# EasyEDA Pro project SD-Swicharoo.eprj, board MicroSD Adapter
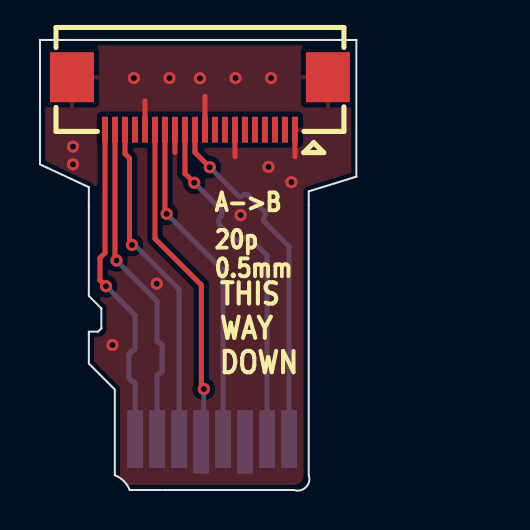
[diagram p4: board, top side]
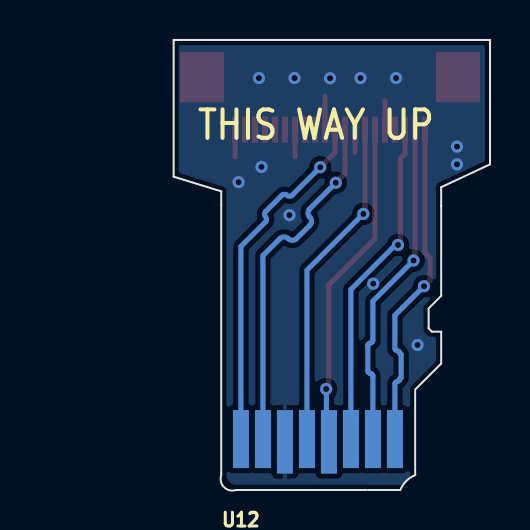
[diagram p5: board, bottom side, seen from below]

Outline 22.51 x 22.51 mm; copper layers: Top Layer, Bottom Layer. Coordinates in mm from the lower left corner of the outline.
Outline path: 2.44,14.21 2.44,15.15 0,16.29 0,22.51 15.82,22.51 15.82,15.68 13.44,14.94 13.44,14.26
Stack: Top Layer 0.035mm / Dielectric1 0.91mm FR4 er 4.5 / Bottom Layer 0.035mm

## Design rules (mm)
template: Custom Config
spacing copperThickness1oz (default): track to track 0.102, other pairs 0.152 to 0.3
spacing copperThickness2oz: track to track 0.203, other pairs 0.152 to 0.3
track width copperThickness1oz (default): min 0.127, default 0.254, max 2.54
track width copperThickness2oz: min 0.203, default 0.254, max 2.54
differential pair differentialPair (default): width min 0.127, default 0.254, max 2.54; gap min 0.152, default 0.152
via viaSize (default): diameter min 0.5, default 0.61, max 10; hole min 0.3, default 0.305, max 6.3

## Placement (name value [footprint] x y rotation side)
U11  05A20L20P  [FPC-SMD_20P-P0.50_L5.9-W14.4]  8 19.34 180 top
U12  U12  [MICROSD]  12.7 14.26 180 bottom

## Footprints (pads in the part's own frame, mm; a bottom-side part is the same pattern mirrored in y, then rotated)
FPC-SMD_20P-P0.50_L5.9-W14.4
  rect 0.3x1.3 smd: 1(-4.75,1.312) 2(-4.25,1.312) 3(-3.75,1.312) 4(-3.25,1.312) 5(-2.75,1.312) 6(-2.25,1.312) 7(-1.75,1.312) 8(-1.25,1.312) 9(-0.75,1.312) 10(-0.25,1.312) 11(0.25,1.312) 12(0.75,1.312) 13(1.25,1.312) 14(1.75,1.312) 15(2.25,1.312) 16(2.75,1.312) 17(3.25,1.312) 18(3.75,1.312) 19(4.25,1.312) 20(4.75,1.312)
  rect 2.2x2.5 smd: 21(-6.4,-1.312) 22(6.4,-1.312)
MICROSD
  custom 0.8x2.9 smd: 1(7.943,-11.711) 2(6.843,-11.711) 3(5.742,-11.711) 5(3.543,-11.711) 7(1.343,-11.711) 8(0.243,-11.711)
  custom 0.8x3.175 smd: 4(4.643,-11.85) 6(2.442,-11.85)

## Nets
As in the schematic.

Pads without a net: U11 2 3 4 5 6 8 9 17

## Via types
v1: diameter 0.61, hole 0.305, Top Layer to Bottom Layer, 19 vias

## Routing (per net, layer and track width the routed paths; a pad name or vN(x,y) marks a point on that pad's centre or on a via; arc(x,y) is an arc through that point)
SDIN_CLK: length 17.4
  Top Layer w0.254: v1(6.34,13.81) 6.25,13.9 U11.14
  Bottom Layer w0.254: v1(6.34,13.81) 9.16,10.99 9.16,1.79
SDIN_CMD: length 17.4
  Top Layer w0.254: U11.18 4.25,16.82 4.48,16.6 4.48,12.39 4.6,12.26
  Bottom Layer w0.254: 6.96,1.79 6.96,10.03 4.73,12.26 4.6,12.26
  vias: v1(4.6,12.26)
SDIN_DAT0: length 18.6
  Top Layer w0.254: v1(7.72,15.37) 7.26,15.83 U11.12
  Bottom Layer w0.254: 11.36,1.79 11.36,11.73 10.51,12.58 arc(10.31,12.66) 10.1,12.58 arc(9.89,12.49) 9.68,12.58 9.02,13.24 arc(8.93,13.45) 9.02,13.65 arc(9.11,13.86) 9.02,14.07 v1(7.72,15.37)
SDIN_DAT1: length 18.6
  Top Layer w0.254: v1(8.49,16.15) 7.76,16.89 U11.11
  Bottom Layer w0.254: 12.46,1.79 12.46,12.18 11.23,13.41 arc(11.18,13.54) 11.23,13.67 arc(11.29,13.8) 11.23,13.92 10.41,14.75 arc(10.29,14.8) 10.16,14.75 arc(10.03,14.69) 9.9,14.75 v1(8.49,16.15)
SDIN_DAT2: length 17.4
  Top Layer w0.254: U11.20 3.25,11.86 3,11.61 3,10.5 v1(3.3,10.2)
  Bottom Layer w0.254: v1(3.3,10.2) 4.76,8.74 4.76,7.09 arc(4.72,7) 4.63,6.96 arc(4.54,6.93) 4.5,6.84 4.45,6.78 4.45,5.63 4.5,5.57 4.5,5.57 arc(4.54,5.48) 4.63,5.44 arc(4.72,5.4) 4.76,5.31 4.76,1.79
SDIN_DAT3: length 17.4
  Top Layer w0.254: U11.19 3.75,11.56 v1(3.83,11.48)
  Bottom Layer w0.254: v1(3.83,11.48) 5.86,9.45 5.86,7.48 arc(5.89,7.39) 5.98,7.36 arc(6.07,7.32) 6.11,7.23 6.11,5.96 arc(6.07,5.87) 5.98,5.83 arc(5.89,5.8) 5.86,5.71 5.86,1.79
SDIN_GND: length 7
  Top Layer w0.254: 5.26,18.06 5.26,19.47 ; 6.76,18.06 6.76,16.89 ; 8.26,18.06 8.26,19.69 ; U11.7 9.76,16.67 ; 12.76,18.06 12.76,16.67
  vias: v1(1.65,17.18) v1(1.65,16.29) v1(3.62,7.26) v1(4.7,20.61) v1(5.84,10.32) v1(6.48,20.61) v1(8,20.6) v1(9.78,20.61) v1(10.03,13.75) v1(11.43,16.16) v1(11.56,20.61) v1(12.57,15.4)
SDIN_VDD: length 17.4
  Top Layer w0.254: U11.15 5.76,12.57 8.07,10.25 8.07,5.05
  Bottom Layer w0.254: 8.07,5.05 8.19,4.94 8.19,1.65
  vias: v1(8.2,5.05)

## Copper pours and planes (outline as drawn; the poured copper is in the pictures)
SDIN_GND on Top Layer: -0.51,22.64 16.51,22.64 16.51,-1.36 -0.51,-1.36
SDIN_GND on Bottom Layer: -2.54,23.02 18.8,23.02 18.8,-2.25 -2.54,-2.25

## Text on the board
Bottom Silkscreen Layer: THIS WAY UP
Top Silkscreen Layer: A->B | 20p / 0.5mm | THIS / WAY / DOWN
